# Altium schematic sheet Board_MCU.SchDoc
size A4
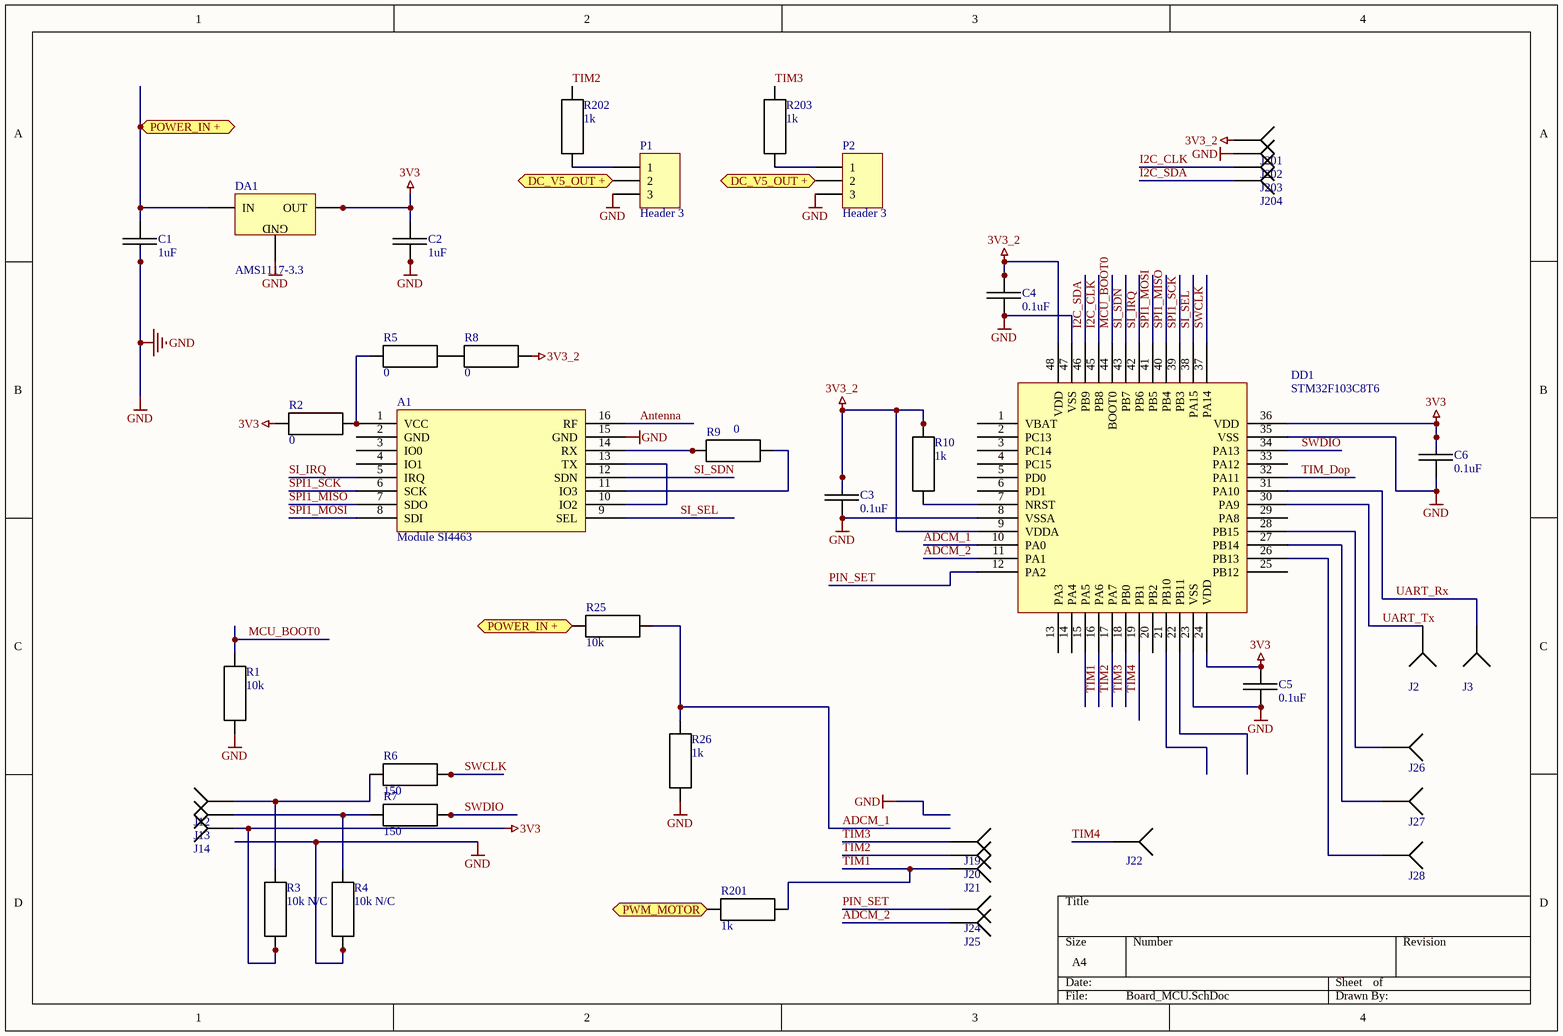
[diagram p0: Board_MCU.SchDoc]

## Parts
A1  Module SI4463  [MODULE_SI44663]
C1  1uF  [CAP0805]
C2  1uF  [CAP0805]
C3  0.1uF  [CAP0805]
C4  0.1uF  [CAP0805]
C5  0.1uF  [CAP0805]
C6  0.1uF  [CAP0805]
DA1  AMS1117-3.3  [SOT-223]
DD1  STM32F103C8T6  [STM32L151C]
J2  X-Socket  [Socket]  (value not drawn)
J3  X-Socket  [Socket]  (value not drawn)
J12  X-Socket  [Socket]  (value not drawn)
J13  X-Socket  [Socket]  (value not drawn)
J14  X-Socket  [Socket]  (value not drawn)
J19  X-Socket  [Socket]  (value not drawn)
J20  X-Socket  [Socket]  (value not drawn)
J21  X-Socket  [Socket]  (value not drawn)
J22  X-Socket  [Socket]  (value not drawn)
J24  X-Socket  [Socket]  (value not drawn)
J25  X-Socket  [Socket]  (value not drawn)
J26  X-Socket  [Socket]  (value not drawn)
J27  X-Socket  [Socket]  (value not drawn)
J28  X-Socket  [Socket]  (value not drawn)
J201  X-Socket  [Socket]  (value not drawn)
J202  X-Socket  [Socket]  (value not drawn)
J203  X-Socket  [Socket]  (value not drawn)
J204  X-Socket  [Socket]  (value not drawn)
P1  Header 3  [HDR1X3]
P2  Header 3  [HDR1X3]
R1  10k  [RES0805]
R2  0  [RES0805]
R3  10k N/C  [RES0603]
R4  10k N/C  [RES0603]
R5  0  [RES0805]
R6  150  [RES0603]
R7  150  [RES0603]
R8  0  [RES0805]
R9  0  [RES0603]
R10  1k  [RES0805]
R25  10k  [RES0805]
R26  1k  [RES0805]
R201  1k  [RES0805]
R202  1k  [RES0805]
R203  1k  [RES0805]

## Ports
DC_V5_OUT +, POWER_IN +, PWM_MOTOR

## Nets
3V3: C2.1 C5.1 C6.1 DA1.2(OUT) DA1.4 DD1.24(VDD) DD1.36(VDD) J14.1 R2.1 R3.2
3V3_2: C3.1 C4.1 DD1.9(VDDA) DD1.48(VDD) J201.1 R8.2 R10.1
GND: A1.15(GND) C1.2 C2.2 C3.2 C4.2 C5.2 C6.2 DA1.1(GND) DD1.8(VSSA) DD1.23(VSS) DD1.35(VSS) DD1.47(VSS) J202.1 P1.3 P2.3 R1.2 R4.2 R26.2
ADCM_1: DD1.10(PA0) R25.2 R26.1
ADCM_2: DD1.11(PA1) J25.1
Antenna: A1.16(RF)
DC_V5_OUT +: P1.2 P2.2 ; port DC_V5_OUT +
I2C_CLK: DD1.45(PB8) J203.1
I2C_SDA: DD1.46(PB9) J204.1
MCU_BOOT0: DD1.44(BOOT0) R1.1
PIN_SET: DD1.12(PA2) J24.1
POWER_IN +: C1.1 DA1.3(IN) R25.1 ; port POWER_IN +
PWM_MOTOR: R201.1 ; port PWM_MOTOR
SI_IRQ: A1.5(IRQ) DD1.42(PB6)
SI_SDN: A1.12(SDN) DD1.43(PB7)
SI_SEL: A1.9(SEL) DD1.38(PA15)
SPI1_MISO: A1.7(SDO) DD1.40(PB4)
SPI1_MOSI: A1.8(SDI) DD1.41(PB5)
SPI1_SCK: A1.6(SCK) DD1.39(PB3)
SWCLK: DD1.37(PA14) R6.1
SWDIO: DD1.34(PA13) R7.1
TIM1: DD1.16(PA6) J21.1 R201.2
TIM2: DD1.17(PA7) J20.1 R202.2
TIM3: DD1.18(PB0) J19.1 R203.2
TIM4: DD1.19(PB1) J22.1
TIM_Dop: DD1.32(PA11)
UART_Rx: DD1.31(PA10) J3.1
UART_Tx: DD1.30(PA9) J2.1
NetA1_1: A1.1(VCC) R2.2 R5.1
NetA1_10: A1.10(IO2) A1.13(TX)
NetA1_11: A1.11(IO3) R9.2
NetA1_14: A1.14(RX) R9.1
NetDD1_7: DD1.7(NRST) R10.2
NetDD1_26: DD1.26(PB13) J28.1
NetDD1_27: DD1.27(PB14) J27.1
NetDD1_28: DD1.28(PB15) J26.1
NetJ12_1: J12.1 R3.1 R6.2
NetJ13_1: J13.1 R4.1 R7.2
NetP1_1: P1.1 R202.1
NetP2_1: P2.1 R203.1
NetR5_2: R5.2 R8.1

Not connected (* = marked no-connect by the designer): A1 2(GND) 3(IO0) 4(IO1); DD1 1(VBAT) 2(PC13) 3(PC14) 4(PC15) 5(PD0) 6(PD1) 13(PA3) 14(PA4) 15(PA5) 20(PB2) 21(PB10) 22(PB11) 25(PB12) 29(PA8) 33(PA12)

## Library data of the parts
A1 = module_SI4463: VCC: 3V3
C1-C6 = Capacitor: Voltage: 50V; dielectric: X7R
  C1 C2: Value: 1uF
  C3-C6: Value: 0.1uF
DA1 = DA-AMS1117: LDO 3.3V 0.5A; Vin: ...15V; Iout: 1.5A; Vout: 3.3
DD1 = STM32F103C8T6: LQFP48
P1 P2 = Header 3: Header, 3-Pin; LatestRevisionDate: 17-Jul-2002; LatestRevisionNote: Re-released for DXP Platform.; Publisher: Altium Limited
R1-R10 R25 R26 R201-R203 = Resistor: Toleance: 1%
  R1 R25: Value: 10k
  R2 R5 R8 R9: Value: 0
  R3 R4: DNI: N/C; Value: 10k
  R6 R7: Value: 150
  R10 R26 R201-R203: Value: 1k